# Altium schematic sheet config.SchDoc
size A
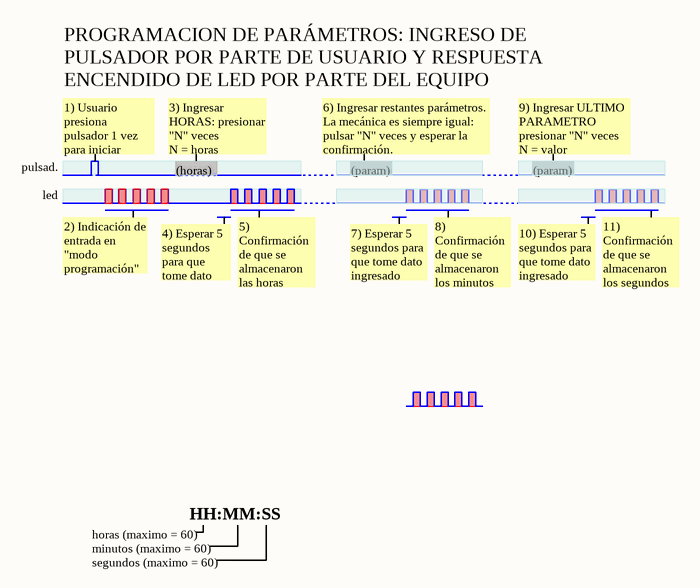
[diagram p0: config.SchDoc]

## Notes on the sheet
- PROGRAMACION DE PARÁMETROS: INGRESO DE PULSADOR POR PARTE DE USUARIO Y RESPUESTA ENCENDIDO DE LED POR PARTE DEL EQUIPO
- 1) Usuario presiona pulsador 1 vez para iniciar configuracion
- 3) Ingresar HORAS: presionar "N" veces
  N = horas
- 6) Ingresar restantes parámetros.
  La mecánica es siempre igual: pulsar "N" veces y esperar la confirmación.
- 9) Ingresar ULTIMO PARAMETRO presionar "N" veces
  N = valor
- pulsad.
- led
- (horas)
- (param)
- 2) Indicación de entrada en "modo programación"
- 4) Esperar 5 segundos para que tome dato ingresado
- 5) Confirmación de que se almacenaron las horas
- 7) Esperar 5 segundos para que tome dato ingresado
- 8) Confirmación de que se almacenaron los minutos
- 10) Esperar 5 segundos para que tome dato ingresado
- 11) Confirmación de que se almacenaron los segundos
- horas (maximo = 60)
  minutos (maximo = 60)
  segundos (maximo = 60)
- HH:MM:SS